# EAGLE design led-module (EAGLE 9.6.2)
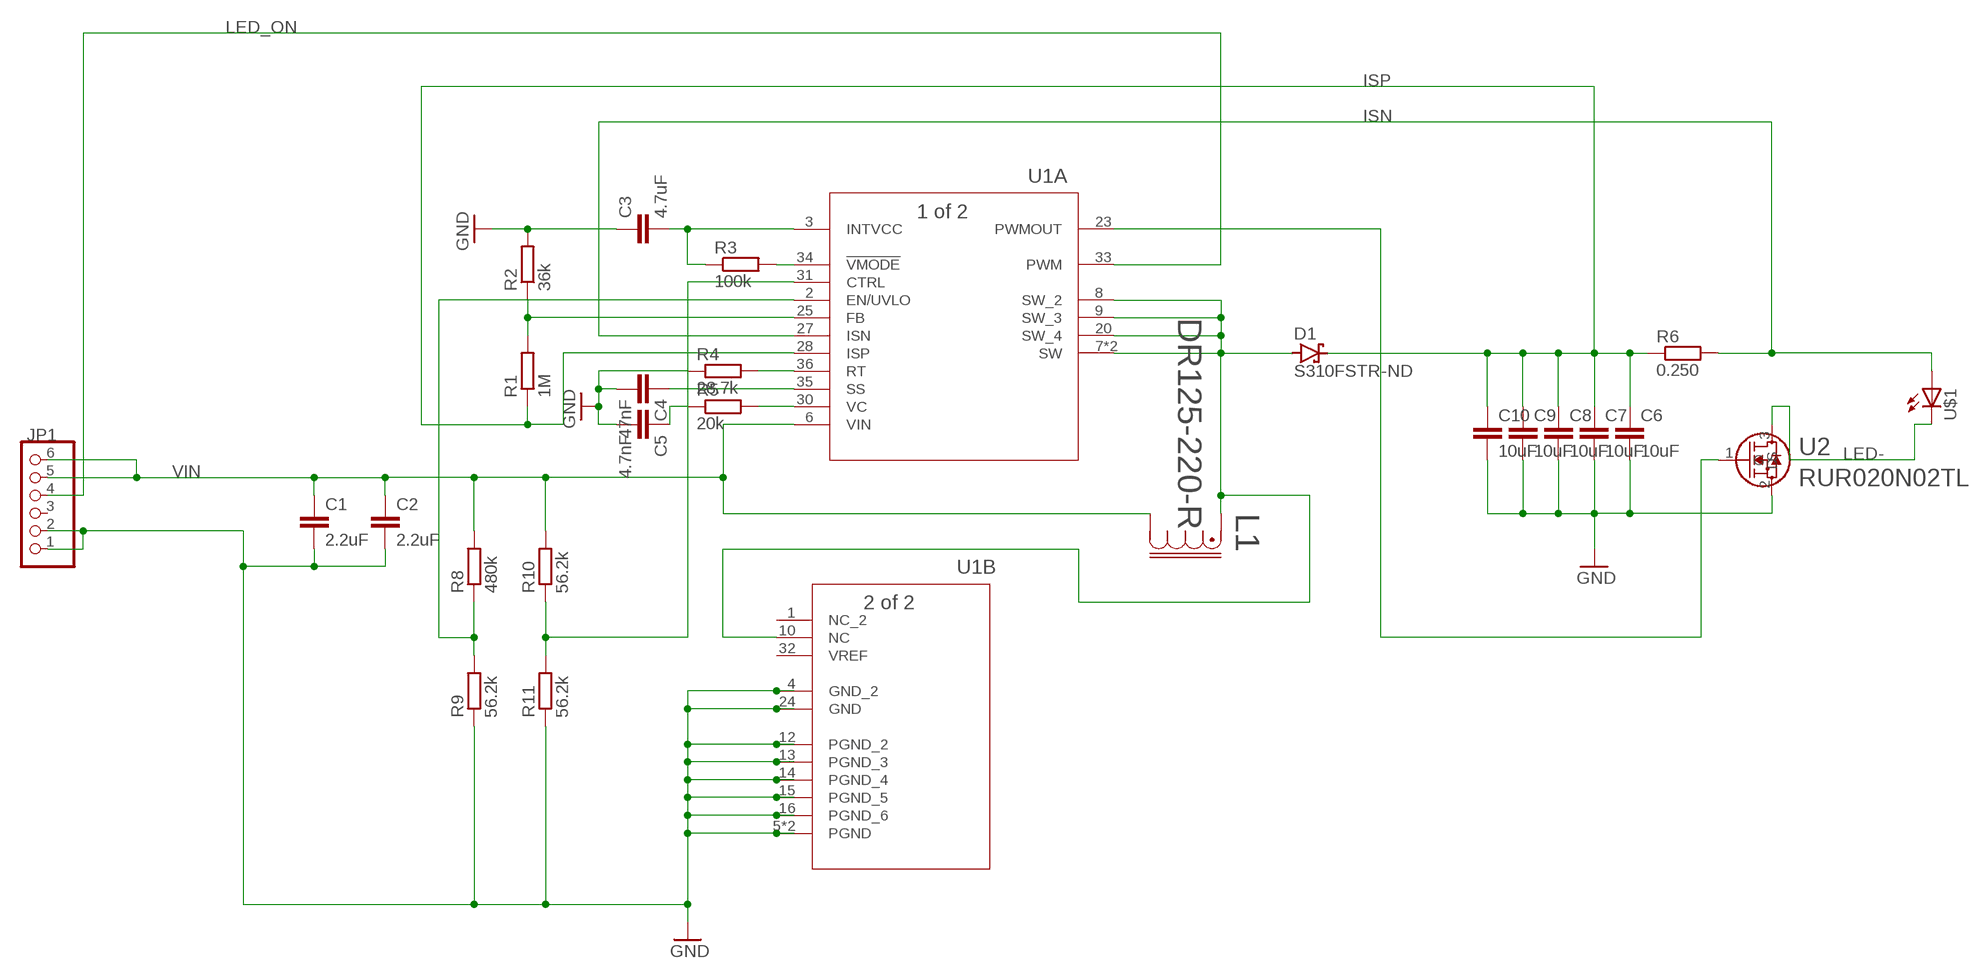
[diagram p0: schematic, sheet 1]

## Parts
C1  2.2uF  C-EUC0805  [C0805]
C2  2.2uF  C-EUC0805  [C0805]
C3  4.7uF  C-EUC0402  [C0402]
C4  47nF  C-EUC0402  [C0402]
C5  4.7nF  C-EUC0402  [C0402]
C6  10uF  C-EUC0805  [C0805]
C7  10uF  C-EUC0805  [C0805]
C8  10uF  C-EUC0805  [C0805]
C9  10uF  C-EUC0805  [C0805]
C10  10uF  C-EUC0805  [C0805]
D1  S310FSTR-ND  SCHOTTKY-DIODESMC  [SMC]
JP1  PINHD-1X6  [1X06]
L1  DR125-220-R  [DR125]
R1  1M  R-EU_R0402  [R0402]
R2  36k  R-EU_R0402  [R0402]
R3  100k  R-EU_R0402  [R0402]
R4  28.7k  R-EU_R0402  [R0402]
R5  20k  R-EU_R0402  [R0402]
R6  0.250  R-EU_WSC2515  [WSC2515]
R8  480k  R-EU_R0402  [R0402]
R9  56.2k  R-EU_R0402  [R0402]
R10  56.2k  R-EU_R0402  [R0402]
R11  56.2k  R-EU_R0402  [R0402]
U1  LT3956EUHEPBFUHE_36_ADI-M  [UHE_36_ADI-M]
U2  RUR020N02TL  [TRANS_RTR020N_ROM]
U$1  5-2154874-3  [5-2154874-3]

## Nets
GND: C1.2 C2.2 C3.1 C4.2 C5.2 C6.2 C7.2 C8.2 C9.2 C10.2 JP1.1 JP1.2 R2.2 R4.1 R9.1 R11.1 U1.4(B:GND_2) U1.5(B:PGND) U1.12(B:PGND_2) U1.13(B:PGND_3) U1.14(B:PGND_4) U1.15(B:PGND_5) U1.16(B:PGND_6) U1.17(B:PGND) U1.24(B:GND) U2.2(S)
ISN: R6.2 U1.27(A:ISN) U$1.P$1(A)
ISP: C6.1 C7.1 C8.1 C9.1 C10.1 D1.C R1.1 R6.1 U1.28(A:ISP)
LED-: U2.3(D) U$1.P$2(C)
LED_ON: JP1.4 U1.33(A:PWM)
N$1: C3.2 R3.1 U1.3(A:INTVCC)
N$3: R1.2 R2.1 U1.25(A:FB)
N$4: R3.2 U1.34(A:!VMODE)
N$5: R4.2 U1.36(A:RT)
N$8: C4.1 U1.35(A:SS)
N$9: R5.2 U1.30(A:VC)
N$10: C5.1 R5.1
N$12: U1.23(A:PWMOUT) U2.1(G)
N$14: D1.A L1.1 U1.7(A:SW) U1.8(A:SW_2) U1.9(A:SW_3) U1.10(B:NC) U1.20(A:SW_4) U1.21(A:SW)
N$15: R8.1 R9.2 U1.2(A:EN/UVLO)
N$16: R10.1 R11.2 U1.31(A:CTRL)
VIN: C1.1 C2.1 JP1.5 JP1.6 L1.2 R8.2 R10.2 U1.6(A:VIN)
Unconnected: JP1.3 U1.1(B:NC_2) U1.32(B:VREF)

## Library data of the parts
C1-C10 = rcl:C-EU: CAPACITOR, European symbol; SPICEPREFIX: C
D1 = diode:SCHOTTKY-DIODE: Schottky Diode
JP1 = pinhead:PINHD-1X6: PIN HEADER
L1 = DR125-220-R:DR125-220-R; COPYRIGHT: Copyright (C) 2021 Ultra Librarian. All rights reserved.; DIGI-KEY_PART_NUMBER_1: 513-1127-1-ND; DIGI-KEY_PART_NUMBER_2: 513-1127-2-ND; DIGI-KEY_PART_NUMBER_3: 513-1127-6-ND; MANUFACTURER_PART_NUMBER: DR125-220-R; MFR_NAME: Cooper Bussmann
R1-R6 R8-R11 = rcl:R-EU_: RESISTOR, European symbol; SPICEPREFIX: R
U1 = lt3956:LT3956EUHEPBF; COPYRIGHT: Copyright (C) 2021 Ultra Librarian. All rights reserved.; DIGI-KEY_PART_NUMBER_1: LT3956EUHE#PBF-ND; MANUFACTURER_PART_NUMBER: LT3956EUHE#PBF; MFR_NAME: Analog Devices Inc
U2 = RUR020N02TL:RUR020N02TL; COPYRIGHT: Copyright (C) 2021 Ultra Librarian. All rights reserved.; DIGI-KEY_PART_NUMBER_1: RUR020N02TLCT-ND; DIGI-KEY_PART_NUMBER_2: RUR020N02TLDKR-ND; DIGI-KEY_PART_NUMBER_3: RUR020N02TLTR-ND; DIGI-KEY_PART_NUMBER_4: RUR020N02TLTR-NDL; MANUFACTURER_PART_NUMBER: RUR020N02TL; MFR_NAME: ROHM Semiconductor
U$1 = 5-2154874-3:5-2154874-3

## Board
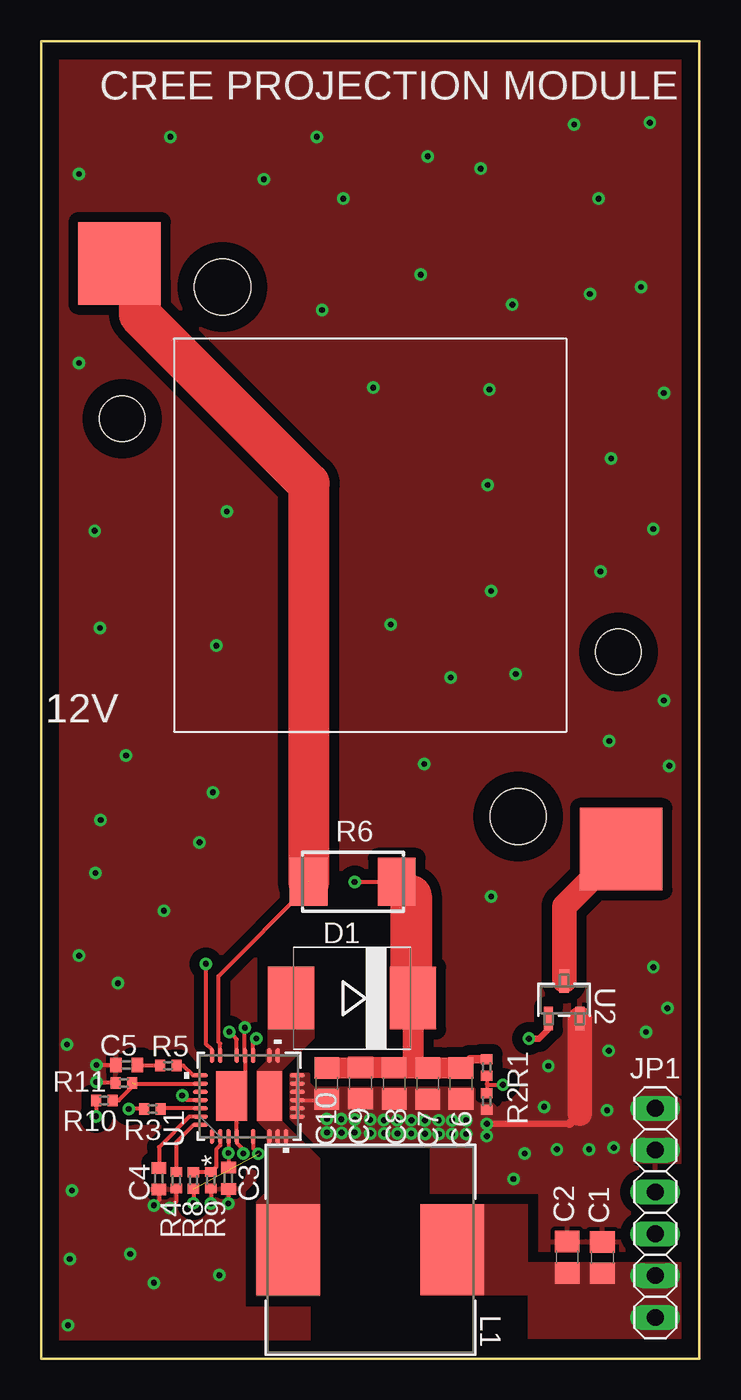
[diagram p1: board, top side]
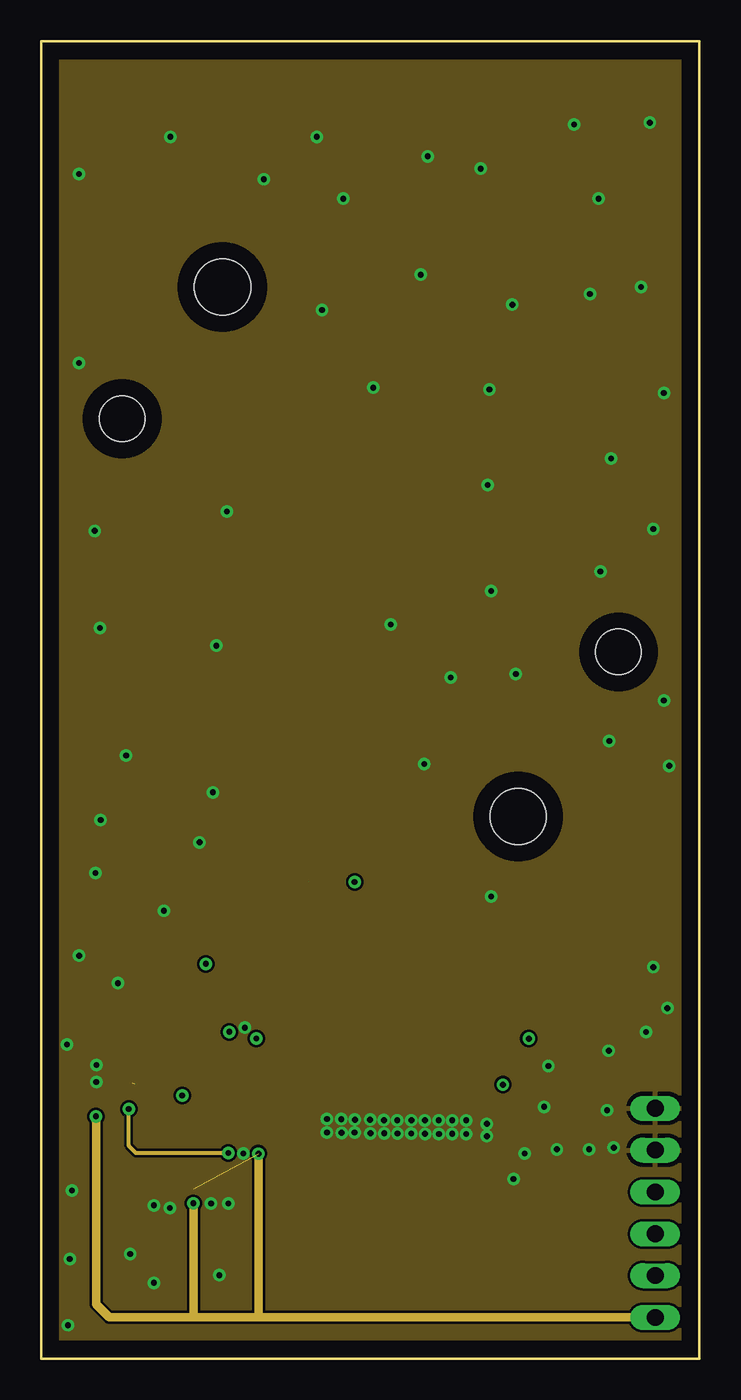
[diagram p2: board, inner layer Route2]
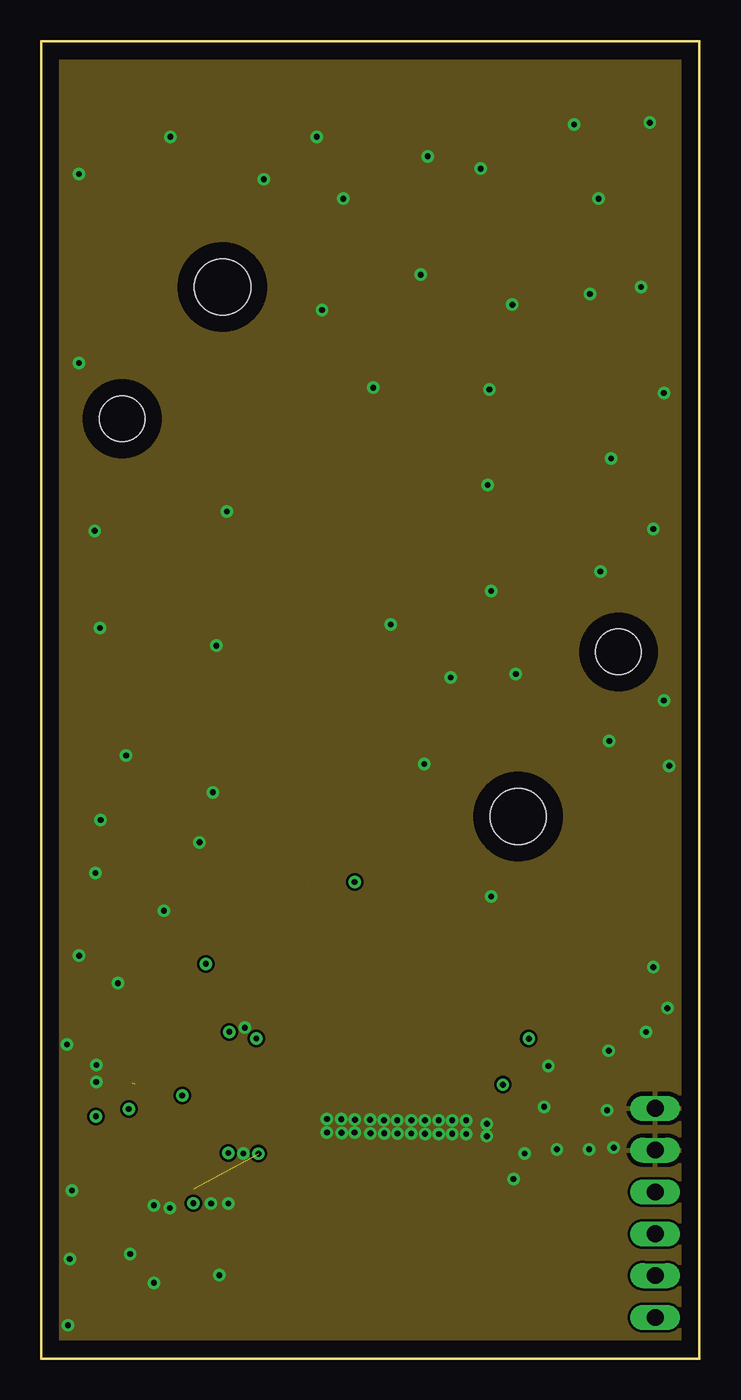
[diagram p3: board, inner layer Route15]
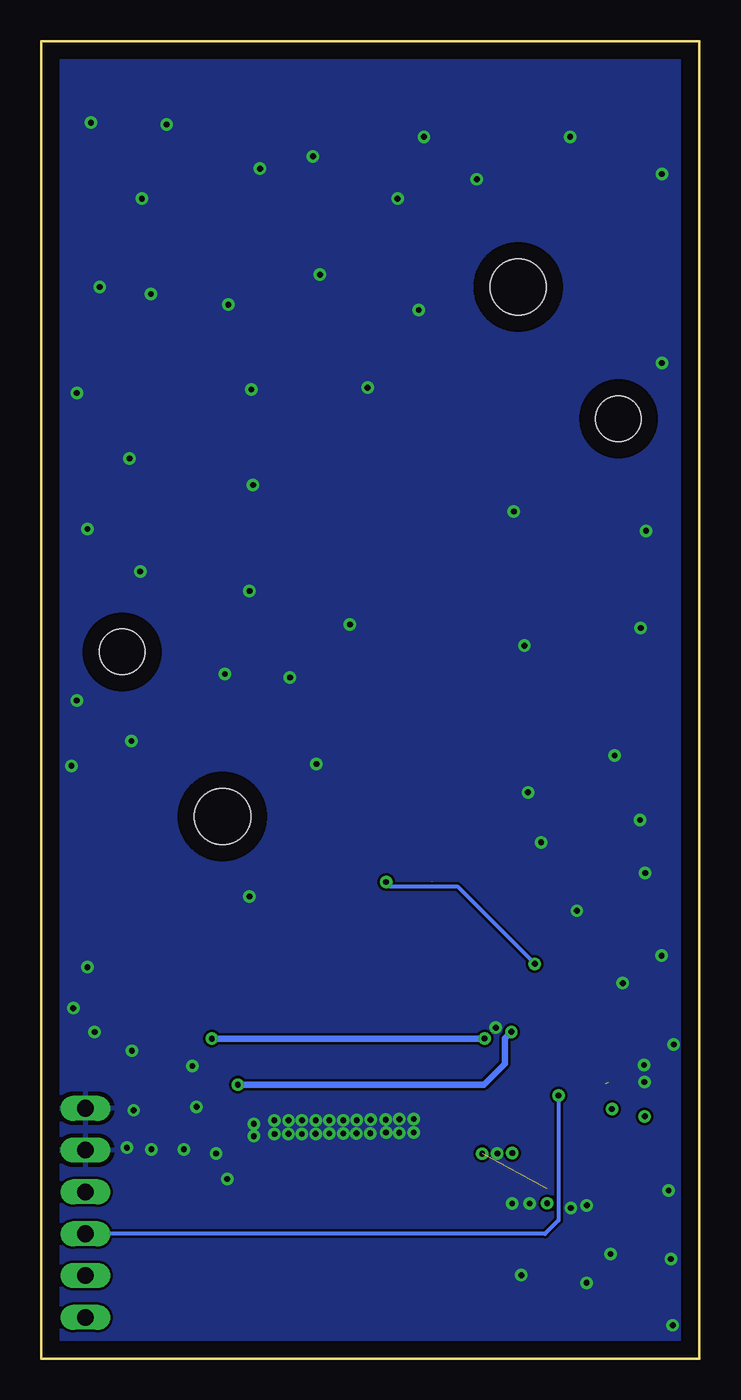
[diagram p4: board, bottom side, seen from below]

Size 40 x 80 mm. Coordinates in mm from the lower left corner, seen from the top.
Outline: 0,0 0,80 40,80 40,0 0,0
Copper layers (1+2*15+16): Top 0.035mm / dielectric 1.5mm / Route2 0.035mm / dielectric 0.15mm / Route15 0.035mm / dielectric 0.2mm / Bottom 0.035mm
Design rules "default *": minimum track width 6mil, minimum drill 0.3mm, track to track 6mil, track to pad 6mil, pad to pad 6mil, via to via 6mil, smd to smd 6mil, copper to edge 40mil, drill to drill 6mil, minimum pad ring 10mil, minimum via ring 8mil, stop-mask expansion 4mil, vias tented up to drill 0mil, thermal gap 10mil

### Footprints (pad centres in the part's own frame; a part is rotated, then mirrored left to right if it is on the bottom)
C0805 = smd 1.3 x 1.5: 1 -0.95,0; 2 0.95,0
C0402 = smd 0.7 x 0.9: 1 -0.65,0; 2 0.65,0
SMC = smd 2.8 x 3.8: A 3.7,0; C -3.7,0
1X06 = drill 1.016 long: 1 -6.35,0; 2 -3.81,0; 3 -1.27,0; 4 1.27,0; 5 3.81,0; 6 6.35,0
DR125 = smd 3.861 x 5.512: 1 -4.978,0; 2 4.978,0
R0402 = smd 0.6 x 0.7: 1 -0.5,0; 2 0.5,0
WSC2515 = smd 2.29 x 2.92: 1 -2.675,0; 2 2.675,0
UHE_36_ADI-M = smd 0.914 x 0.254: 1 -2.451,2.25; 2 -2.451,1.75; 3 -2.451,1.25; 4 -2.451,0.75; 6 -2.451,-0.25; 8 -2.451,-1.25; 9 -2.451,-1.75; 10 -2.451,-2.25; 20 2.451,-1.75; 21 2.451,-1.25; 23 2.451,-0.25; 24 2.451,0.25; 25 2.451,0.75; 27 2.451,1.75; 28 2.451,2.25 | smd 3 x 1.88: 5 0,1.067 | smd 3 x 1.53: 7 0,-1.245 | smd 0.254 x 0.914: 12 -1.25,-2.946; 13 -0.75,-2.946; 14 -0.25,-2.946; 15 0.25,-2.946; 16 0.75,-2.946; 17 1.25,-2.946; 30 1.25,2.946; 31 0.75,2.946; 32 0.25,2.946; 33 -0.25,2.946; 34 -0.75,2.946; 35 -1.25,2.946; 36 -1.75,2.946
TRANS_RTR020N_ROM = smd 0.559 x 1.422: 1 -0.95,-1.143; 2 0.95,-1.143; 3 0,1.143
5-2154874-3 = smd 5 x 5: P$1 15.24,-16.51; P$2 -15.24,19.05 | hole 3.4: -8.98,17.08; 8.98,-15.08 | hole 2.75: -15.08,7.08; 15.08,-7.08

### Placement (x,y rotation side)
C1  34.09,6.14 90 top
C2  31.96,6.17 90 top
C3  11.38,10.96 90 top
C4  7.16,10.93 270 top
C5  5.2,17.83 180 top
C6  25.5,16.71 270 top
C7  23.48,16.71 270 top
C8  21.45,16.72 270 top
C9  19.4,16.74 270 top
C10  17.35,16.71 270 top
D1  18.89,21.89 180 top
JP1  37.31,8.86 270 top
L1  20,6.62 0 top
R1  27.07,17.7 270 top
R2  27.07,15.63 270 top
R3  6.76,15.17 0 top
R4  8.21,10.84 90 top
R5  7.72,17.8 0 top
R6  18.92,28.96 180 top
R8  9.26,10.83 270 top
R9  10.32,10.84 90 top
R10  3.84,15.68 180 top
R11  5.04,16.75 0 top
U1  12.63,15.96 90 top
U2  31.77,21.8 0 top
U$1  20,50 180 top

### Tracks (layer width: path | path; a pad name or v marks a point on that pad's centre or on a via)
GND  (via drill 0.35)
  Top 0.25: v12.29,12.47 12.29,12.7 11.88,13.11 U1.4 11.88,15.53 11.94,15.59 11.92,15.59 U1.5 12.38,16.77 U1.24 v12.37,20.1 | C4.2 7.16,9.62 v6.85,9.32 | R4.1 8.21,9.55 v7.82,9.16 | R9.1 v10.32,9.43 | C3.1 v11.38,9.44 v11.38,9.43 | R11.1 3.41,16.75 v3.35,16.81 | C5.2 3.37,17.83 v3.36,17.84 | U1.14 17.29,15.71 C10.2 | U1.17 U1.16 U1.15 U1.14 | U1.14 U1.13 U1.12
  Top 0.406: 32.1,14.26 v27.08,14.26 v27.08,14.27
  Top 0.508: 32.73,14.89 32.1,14.26
  Top 1.5: U2.2 32.73,14.89
  other vias: 17.36,14.56 17.36,13.73 18.24,14.55 18.25,13.72 19.05,13.73 19.07,14.52 19.99,14.52 20.83,14.49 21.64,14.48 22.49,14.49 23.31,14.48 24.15,14.49 24.97,14.48 25.83,14.48 25.82,13.65 24.97,13.66 24.16,13.65 23.32,13.66 22.49,13.68 21.65,13.68 20.85,13.69 20,13.69 27.08,13.52 1.63,2.04 1.74,6.06 1.88,10.22 1.57,19.09 4.66,22.8 2.31,24.48 7.45,27.2 3.3,29.5 9.62,31.36 3.61,32.72 10.43,34.4 5.16,36.63 3.57,44.37 10.64,43.3 3.25,50.27 11.28,51.45 2.29,60.46 2.29,71.94 7.86,74.19 13.53,71.62 17.07,63.68 18.35,70.44 16.74,74.19 23.49,73.01 23.06,65.83 26.7,72.26 28.63,64 33.88,70.44 32.38,74.94 36.98,75.05 36.44,65.07 33.34,64.64 37.84,58.64 34.62,54.67 37.19,50.38 33.98,47.8 37.84,39.97 34.52,37.51 38.16,36 27.34,28.07 23.27,36.11 37.19,23.78 24.88,41.37 27.13,53.06 20.17,58.96 27.24,58.85 21.24,44.59 27.34,46.62 28.84,41.58 5.41,6.37 6.85,4.61 10.83,5.08 34.79,12.82 33.3,12.72 31.33,12.72 29.37,12.46 28.7,10.91 34.38,15.09 30.56,15.3 30.82,17.78 34.48,18.7 36.76,19.84 38.05,21.29
  pour Top (isolate 0.61, rank 2): 43.19,82.21 43.19,-3.12 -2.84,-3.12 -2.84,82.48
  pour Route2: 42.92,82.21 42.92,-3.12 -3.12,-3.12 -3.12,82.48
  pour Route15: 42.88,82.15 42.88,-3.17 -3.16,-3.17 -3.16,82.42
  pour Bottom: 43.07,82.15 43.07,-3.17 -2.97,-3.17 -2.97,82.42
  pour Top (no thermals): 15.16,17.35 15.1,17.29 15.1,14.58 16.61,13.06 17.34,13.06 27.89,13.06 27.91,13.09 27.91,15.05 27.5,15.46 27.46,15.51 26.6,15.51 26.4,15.71 26.4,16.36 26.27,16.49 26.09,16.49 16.59,16.49 16.34,16.74 16.34,17.29 16.27,17.35 15.18,17.35 15.16,17.33
  pour Top (no thermals): 38.95,15.65 38,16.6 29.43,16.6 27.8,14.97 27.8,12.55 28.02,12.33 28.47,11.89 38.95,11.89
ISN  (1 unrouted)
  Top 0.25: U1.27 10.88,19.14 10.77,19.24 10.77,23.24 16.25,28.71 R6.2
  Top 2.5: 16.25,53.14 R6.2
  Top 2.54: U$1.P$1 6,65.27 6,63.4 16.25,53.14
ISP  (via drill 0.35)
  Top 0.25: U1.28 10.38,18.76 10.01,19.13 v10.01,23.98 | v19.05,28.95 21.59,28.95 R6.1
  Top 0.508: R1.1 26.04,18.2 C6.1
  Top 1.27: C10.1 19.37,17.66 C9.1 21.43,17.69 C8.1 22.56,17.67 | 22.56,17.67 23.47,17.67 C7.1 C6.1 | D1.C 22.59,17.7 22.56,17.67
  Top 2.2: 22.46,28.1 R6.1
  Top 2.54: D1.C 22.46,22.03 22.46,28.1
  Bottom 0.25: v10.01,23.98 14.71,28.69 18.78,28.69 v19.05,28.95
LED-
  Top 1.5: U2.3 31.77,27.48 U$1.P$2
LED_ON  (via drill 0.35)
  Top 0.25: U1.33 8.85,15.71 v8.57,15.99
  Bottom 0.25: v8.57,15.99 8.57,8.41 9.39,7.59 JP1.4
N$1  (via drill 0.35)
  Top 0.25: U1.3 v11.38,12.49 C3.2 | R3.1 v5.32,15.17
  Route2 0.25: v11.38,12.49 5.77,12.49 5.32,12.94 v5.32,15.17
N$3  (via drill 0.35)
  Top 0.25: R1.2 27.07,16.69 | 27.07,16.69 R2.1 | 27.07,16.69 27.12,16.64 v28.05,16.64 | U1.25 11.88,19.4 11.77,19.5 11.77,19.51 v11.43,19.85
  Bottom 0.406: v28.05,16.64 13.09,16.64 11.83,17.91 11.83,19.45 v11.43,19.85
N$4
  Top 0.25: U1.34 7.3,15.21 R3.2
N$5
  Top 0.25: U1.36 9.26,14.21 8.21,13.15 R4.2
N$8
  Top 0.25: U1.35 9,14.7 7.16,12.86 C4.1
N$9
  Top 0.25: U1.30 9.22,17.21 8.63,17.8 R5.2
N$10
  Top 0.25: R5.1 5.88,17.8 C5.1
N$12  (via drill 0.35)
  Top 0.25: U1.23 12.88,19.25 v13.07,19.44
  Top 0.406: U2.1 30.82,20.02 30.25,19.44 v29.63,19.44
  Bottom 0.406: v13.07,19.44 v29.63,19.44
N$14
  pour Top (no thermals): 13.77,18.85 13.67,18.75 13.67,18.03 13.09,17.45 13.09,14.49 13.69,13.89 13.69,10.13 13.13,9.56 13.07,9.51 13.07,3.82 13.07,3.82 16.93,3.82 16.98,3.86 16.98,12.11 14.65,14.44 14.65,17.53 15.71,18.59 16.6,19.48 16.6,23.79 13.77,23.8
N$15
  Top 0.25: U1.2 10.88,12.96 10.63,12.71 10.63,11.65 R9.2 R8.1
N$16  (1 unrouted)
  Top 0.25: 5.71,16.71 U1.31 | 4.69,15.68 R10.1 4.72,15.68 5.54,16.5 R11.2
VIN  (via drill 0.35)  (1 unrouted)
  Top 0.25: U1.6 12.88,12.78 v13.2,12.45 | R8.2 9.26,9.45 v9.25,9.45 | R10.2 3.34,14.73 v3.33,14.72
  Route2 0.508: JP1.6 9.25,2.51 | 9.25,2.51 4.12,2.51 3.33,3.31 v3.33,14.72 | v13.2,12.45 13.2,2.51 13.26,2.51 | v9.25,9.45 9.25,2.51
  pour Top (no thermals): 23.02,9.37 29.55,9.37 29.55,6.79 29.55,5.86 39.08,5.86 39.08,1.22 29.92,1.22 29.6,1.22 29.6,3.71 29.6,3.85 26.4,3.85 26.4,9.36 27.05,9.36

### Text on the board
tNames: CREE PROJECTION MODULE | 12V